# EAGLE schematic SensorBoard_Rev1 (EAGLE 4.16)
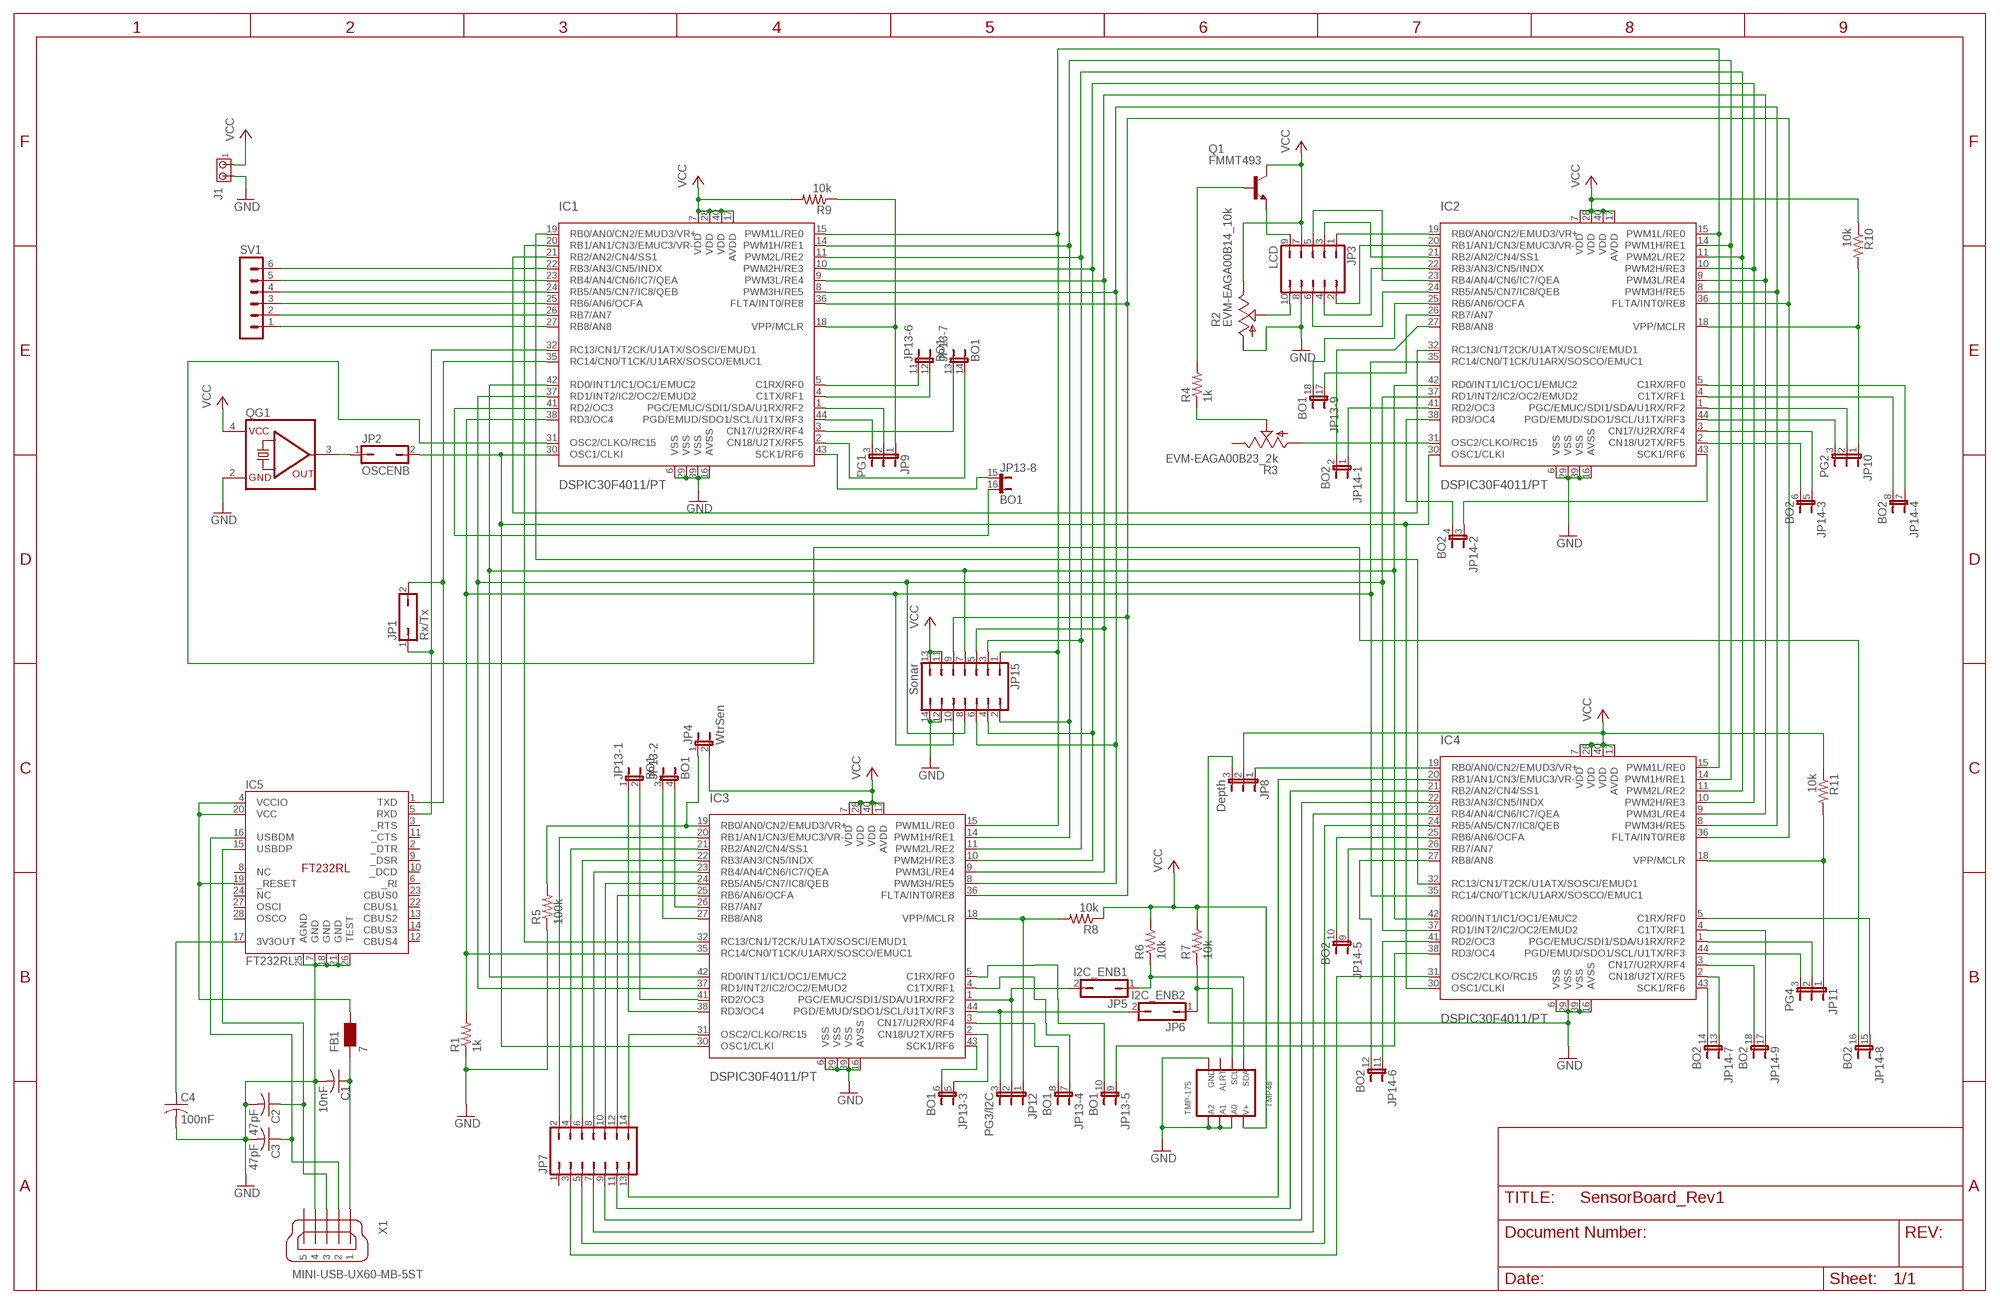
[diagram p0: schematic, sheet 1]

## Parts
C1  10nF  C-USC1206K  [C1206K]
C2  47pF  C-USC1206K  [C1206K]
C3  47pF  C-USC1206K  [C1206K]
C4  100nF  C-USC1206K  [C1206K]
FB1  7  WE-CBF_0805  [0805]
IC1  DSPIC30F4011/PT  [TQFP44]
IC2  DSPIC30F4011/PT  [TQFP44]
IC3  DSPIC30F4011/PT  [TQFP44]
IC4  DSPIC30F4011/PT  [TQFP44]
IC5  FT232RL  [SSOP-28]
J1  MTA02-156  [1X2MTA]
JP1  Rx/Tx  JP1Q  [JP1]
JP2  OSCENB  JP1Q  [JP1]
JP3  LCD  JP5Q  [JP5Q]
JP4  WtrSen  JP1E  [JP1]
JP5  I2C_ENB1  JP1Q  [JP1]
JP6  I2C_ENB2  JP1Q  [JP1]
JP7  JP7Q  [JP7Q]
JP8  Depth  JP2E  [JP2]
JP9  PG1  JP2E  [JP2]
JP10  PG2  JP2E  [JP2]
JP11  PG4  JP2E  [JP2]
JP12  PG3/I2C  JP2E  [JP2]
JP13  BO1  JP9QE  [JP9Q]
JP14  BO2  JP9QE  [JP9Q]
JP15  Sonar  JP7Q  [JP7Q]
Q1  FMMT493  -NPN-SOT23-EBC  [SOT23-EBC]
QG1  SG531  [DIL08-4]
R1  1k  R-US_R1206  [R1206]
R2  EVM-EAGA00B14_10k  TRIM_US-CT6  [CT6]
R3  EVM-EAGA00B23_2k  TRIM_US-CT6  [CT6]
R4  1k  R-US_R1206  [R1206]
R5  100k  R-US_R1206  [R1206]
R6  10k  R-US_R1206  [R1206]
R7  10k  R-US_R1206  [R1206]
R8  10k  R-US_R1206  [R1206]
R9  10k  R-US_R1206  [R1206]
R10  10k  R-US_R1206  [R1206]
R11  10k  R-US_R1206  [R1206]
SV1  MA06-1  [MA06-1]
TMP48  TMP-175  [SO-08]
X1  MINI-USB-UX60-MB-5ST  [UX60-MB-5ST]

## Nets
GND [4amps]: C1.2 C2.2 C3.2 C4.2 IC1.6(VSS) IC1.16(AVSS) IC1.29(VSS) IC1.39(VSS) IC2.6(VSS) IC2.16(AVSS) IC2.29(VSS) IC2.39(VSS) IC3.6(VSS) IC3.16(AVSS) IC3.29(VSS) IC3.39(VSS) IC4.6(VSS) IC4.16(AVSS) IC4.29(VSS) IC4.39(VSS) IC5.7(GND) IC5.18(GND) IC5.21(GND) IC5.25(AGND) IC5.26(TEST) J1.2 JP3.8 JP8.3 JP15.12 JP15.14 QG1.2(GND) R1.1 R2.A R5.1 TMP48.4 TMP48.5 TMP48.6 TMP48.7 X1.4
N$1: IC1.19(RB0/AN0/CN2/EMUD3/VR+) IC4.32(RC13/CN1/T2CK/U1ATX/SOSCI/EMUD1)
N$2: IC1.20(RB1/AN1/CN3/EMUC3/VR-) IC3.32(RC13/CN1/T2CK/U1ATX/SOSCI/EMUD1)
N$3: IC1.21(RB2/AN2/CN4/SS1) IC2.32(RC13/CN1/T2CK/U1ATX/SOSCI/EMUD1)
N$4: IC1.22(RB3/AN3/CN5/INDX) SV1.6
N$5: IC1.24(RB5/AN5/CN7/IC8/QEB) SV1.4
N$6: IC1.25(RB6/AN6/OCFA) SV1.3
N$7: IC1.26(RB7/AN7) SV1.2
N$8: IC1.27(RB8/AN8) SV1.1
N$9: IC1.30(OSC1/CLKI) IC2.30(OSC1/CLKI) IC3.30(OSC1/CLKI) IC4.30(OSC1/CLKI) JP2.2
N$10: C2.1 IC5.15(USBDP) X1.3
N$11: C1.1 FB1.1 X1.1
N$12: C3.1 IC5.16(USBDM) X1.2
N$13: C4.1 IC5.17(3V3OUT)
N$14: FB1.2 IC5.4(VCCIO) IC5.19(_RESET) IC5.20(VCC)
N$15: IC1.32(RC13/CN1/T2CK/U1ATX/SOSCI/EMUD1) IC5.5(RXD) JP1.1
N$16: IC1.35(RC14/CN0/T1CK/U1ARX/SOSCO/EMUC1) IC5.1(TXD) JP1.2
N$17: JP2.1 QG1.3(OUT)
N$18: IC1.23(RB4/AN4/CN6/IC7/QEA) SV1.5
N$19: IC1.15(PWM1L/RE0) IC2.15(PWM1L/RE0) IC3.15(PWM1L/RE0) IC4.15(PWM1L/RE0) JP15.1
N$20: IC1.14(PWM1H/RE1) IC2.14(PWM1H/RE1) IC3.14(PWM1H/RE1) IC4.14(PWM1H/RE1) JP15.2
N$21: IC1.11(PWM2L/RE2) IC2.11(PWM2L/RE2) IC3.11(PWM2L/RE2) IC4.11(PWM2L/RE2) JP15.3
N$22: IC1.10(PWM2H/RE3) IC2.10(PWM2H/RE3) IC3.10(PWM2H/RE3) IC4.10(PWM2H/RE3) JP15.4
N$23: IC1.9(PWM3L/RE4) IC2.9(PWM3L/RE4) IC3.9(PWM3L/RE4) IC4.9(PWM3L/RE4) JP15.5
N$24: IC1.8(PWM3H/RE5) IC2.8(PWM3H/RE5) IC3.8(PWM3H/RE5) IC4.8(PWM3H/RE5) JP15.6
N$25: IC1.42(RD0/INT1/IC1/OC1/EMUC2) IC2.42(RD0/INT1/IC1/OC1/EMUC2) IC3.42(RD0/INT1/IC1/OC1/EMUC2) IC4.42(RD0/INT1/IC1/OC1/EMUC2) JP15.7
N$26: IC1.37(RD1/INT2/IC2/OC2/EMUD2) IC2.37(RD1/INT2/IC2/OC2/EMUD2) IC3.37(RD1/INT2/IC2/OC2/EMUD2) IC4.37(RD1/INT2/IC2/OC2/EMUD2) JP15.8
N$27: IC1.38(RD3/OC4) IC2.35(RC14/CN0/T1CK/U1ARX/SOSCO/EMUC1) IC3.35(RC14/CN0/T1CK/U1ARX/SOSCO/EMUC1) IC4.35(RC14/CN0/T1CK/U1ARX/SOSCO/EMUC1) JP15.10 R1.2
N$28: IC1.36(FLTA/INT0/RE8) IC2.36(FLTA/INT0/RE8) IC3.36(FLTA/INT0/RE8) IC4.36(FLTA/INT0/RE8) JP15.9
N$29: IC2.19(RB0/AN0/CN2/EMUD3/VR+) JP3.1
N$30: IC2.20(RB1/AN1/CN3/EMUC3/VR-) JP3.2
N$31: IC2.21(RB2/AN2/CN4/SS1) JP3.3
N$32: IC2.22(RB3/AN3/CN5/INDX) JP3.4
N$33: IC2.23(RB4/AN4/CN6/IC7/QEA) JP3.5
N$34: IC2.24(RB5/AN5/CN7/IC8/QEB) JP3.6
N$35: JP3.10 R2.S
N$36: IC2.31(OSC2/CLKO/RC15) R3.A
N$37: R3.S R4.1
N$38: JP3.9 Q1.E
N$39: Q1.B R4.2
N$40: IC3.21(RB2/AN2/CN4/SS1) JP7.4
N$41: IC3.19(RB0/AN0/CN2/EMUD3/VR+) JP4.1 R5.2
N$42: IC3.22(RB3/AN3/CN5/INDX) JP7.6
N$43: JP6.1 R7.1 TMP48.2
N$44: JP5.1 R6.1 TMP48.1
N$45: IC3.1(PGC/EMUC/SDI1/SDA/U1RX/RF2) JP5.2 JP12.2
N$46: IC3.44(PGD/EMUD/SDO1/SCL/U1TX/RF3) JP6.2 JP12.3
N$47: IC3.23(RB4/AN4/CN6/IC7/QEA) JP7.8
N$48: IC3.24(RB5/AN5/CN7/IC8/QEB) JP7.10
N$49: IC3.25(RB6/AN6/OCFA) JP7.12
N$50: IC3.20(RB1/AN1/CN3/EMUC3/VR-) JP7.2
N$51: IC3.31(OSC2/CLKO/RC15) JP7.14
N$52: IC4.19(RB0/AN0/CN2/EMUD3/VR+) JP8.1
N$53: IC4.20(RB1/AN1/CN3/EMUC3/VR-) JP7.13
N$54: IC4.21(RB2/AN2/CN4/SS1) JP7.11
N$55: IC4.22(RB3/AN3/CN5/INDX) JP7.9
N$56: IC4.23(RB4/AN4/CN6/IC7/QEA) JP7.7
N$57: IC4.24(RB5/AN5/CN7/IC8/QEB) JP7.5
N$58: IC4.31(OSC2/CLKO/RC15) JP7.3
N$59: IC3.18(VPP/MCLR) JP12.1 R8.2
N$60: IC1.18(VPP/MCLR) JP9.1 R9.1
N$61: IC2.18(VPP/MCLR) JP10.1 R10.2
N$62: IC1.1(PGC/EMUC/SDI1/SDA/U1RX/RF2) JP9.2
N$63: IC1.44(PGD/EMUD/SDO1/SCL/U1TX/RF3) JP9.3
N$64: IC2.1(PGC/EMUC/SDI1/SDA/U1RX/RF2) JP10.2
N$65: IC2.44(PGD/EMUD/SDO1/SCL/U1TX/RF3) JP10.3
N$66: IC4.18(VPP/MCLR) JP11.1 R11.2
N$67: IC4.1(PGC/EMUC/SDI1/SDA/U1RX/RF2) JP11.2
N$68: IC4.44(PGD/EMUD/SDO1/SCL/U1TX/RF3) JP11.3
N$69: IC3.38(RD3/OC4) JP13.1
N$70: IC3.41(RD2/OC3) JP13.2
N$71: IC3.27(RB8/AN8) JP13.3
N$72: IC3.26(RB7/AN7) JP13.4
N$73: IC3.2(CN18/U2TX/RF5) JP13.5
N$74: IC3.43(SCK1/RF6) JP13.6
N$75: IC3.4(C1TX/RF1) JP13.7
N$76: IC3.3(CN17/U2RX/RF4) JP13.8
N$77: IC3.5(C1RX/RF0) JP13.10
N$78: IC1.43(SCK1/RF6) JP13.15
N$79: IC1.2(CN18/U2TX/RF5) JP13.14
N$80: IC1.3(CN17/U2RX/RF4) JP13.13
N$81: IC1.4(C1TX/RF1) JP13.12
N$82: IC1.5(C1RX/RF0) JP13.11
N$83: IC1.41(RD2/OC3) JP13.16
N$84: IC2.25(RB6/AN6/OCFA) JP13.18
N$85: IC2.26(RB7/AN7) JP13.17
N$86: IC2.27(RB8/AN8) JP14.2
N$87: IC2.41(RD2/OC3) JP14.1
N$88: IC2.38(RD3/OC4) JP14.4
N$89: IC2.43(SCK1/RF6) JP14.3
N$90: IC2.2(CN18/U2TX/RF5) JP14.6
N$91: IC2.3(CN17/U2RX/RF4) JP14.5
N$92: IC2.5(C1RX/RF0) JP14.7
N$93: IC2.4(C1TX/RF1) JP14.8
N$94: IC4.25(RB6/AN6/OCFA) JP14.10
N$95: IC4.26(RB7/AN7) JP14.9
N$96: IC4.27(RB8/AN8) JP14.12
N$97: IC4.41(RD2/OC3) JP14.11
N$98: IC4.43(SCK1/RF6) JP14.14
N$99: IC4.2(CN18/U2TX/RF5) JP14.13
N$100: IC4.3(CN17/U2RX/RF4) JP14.18
N$101: IC4.4(C1TX/RF1) JP14.17
N$102: IC4.5(C1RX/RF0) JP14.15
N$103: IC4.38(RD3/OC4) JP13.9
N$104: IC1.31(OSC2/CLKO/RC15) JP14.16
VCC [4amps]: IC1.7(VDD) IC1.17(AVDD) IC1.28(VDD) IC1.40(VDD) IC2.7(VDD) IC2.17(AVDD) IC2.28(VDD) IC2.40(VDD) IC3.7(VDD) IC3.17(AVDD) IC3.28(VDD) IC3.40(VDD) IC4.7(VDD) IC4.17(AVDD) IC4.28(VDD) IC4.40(VDD) J1.1 JP3.7 JP4.2 JP8.2 JP15.11 JP15.13 Q1.C QG1.4(VCC) R2.E R6.2 R7.2 R8.1 R9.2 R10.1 R11.1 TMP48.8
Unconnected: IC5.2(_DTR) IC5.3(_RTS) IC5.6(_RI) IC5.8(NC) IC5.9(_DSR) IC5.10(_DCD) IC5.11(_CTS) IC5.12(CBUS4) IC5.13(CBUS2) IC5.14(CBUS3) IC5.22(CBUS1) IC5.23(CBUS0) IC5.24(NC) IC5.27(OSCI) IC5.28(OSCO) JP7.1 R3.E TMP48.3 X1.5

## Library data of the parts
C1-C4 = rcl:C-US: CAPACITOR, American symbol
FB1 = wuerth-elektronik:WE-CBF: SMD EMI Suppression Ferrite Beads - excellent anti-EMI properties - low DCR - impedances till 3000 ohms - rated current up to 6 A
IC1-IC4 = microchip-dspic:DSPIC30F4011: dsPIC Motion Controller DSC
IC5 = ftdi4:FT232RL
J1 = con-amp:MTA02-156: AMP connector
JP1 JP2 JP5 JP6 = jumper:JP1Q: JUMPER
JP3 = jumper:JP5Q: JUMPER
JP4 = jumper:JP1E: JUMPER
JP7 JP15 = jumper:JP7Q: JUMPER
JP8-JP12 = jumper:JP2E: JUMPER
JP13 JP14 = jumper:JP9QE: JUMPER
Q1 = transistor:*-NPN-: NPN Transistror
QG1 = crystal:SG531: CRYSTAL RESONATOR
R1 R4-R11 = rcl:R-US_: RESISTOR, American symbol
R2 R3 = pot:TRIM_US-: POTENTIOMETER
SV1 = con-lstb:MA06-1: PIN HEADER
TMP48 = texas:TMP-175
X1 = con-hirose:MINI-USB-: MINI USB Connector Source: http://www.hirose.co.jp/cataloge_hp/e24000019.pdf

## Net classes
0 default: width 0.051 mm
1 2amps: width 0.178 mm
2 4amps: width 0.533 mm